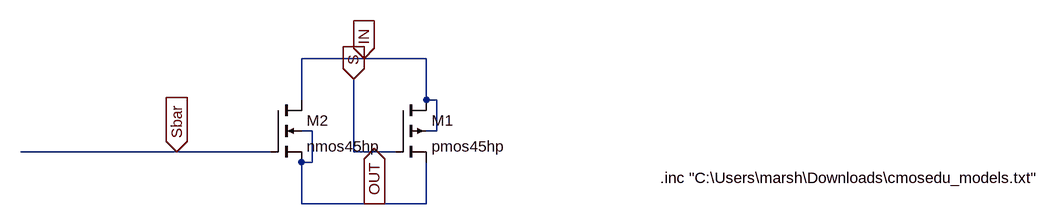
[diagram p0: schematic transgate5.asc]
transgate5.asc, the LTspice schematic file:
Version 4.1
SHEET 1 1048 680
WIRE -64 -48 -160 -48
WIRE 32 -48 -64 -48
WIRE -160 16 -160 -48
WIRE 32 16 32 -48
WIRE 48 16 32 16
WIRE -144 64 -160 64
WIRE 48 64 48 16
WIRE 48 64 32 64
WIRE -352 96 -592 96
WIRE -208 96 -352 96
WIRE -80 96 -80 -16
WIRE -16 96 -80 96
WIRE -144 112 -144 64
WIRE -144 112 -160 112
WIRE -160 176 -160 112
WIRE -48 176 -160 176
WIRE 32 176 32 112
WIRE 32 176 -48 176
FLAG -64 -48 IN
IOPIN -64 -48 In
FLAG -48 176 OUT
IOPIN -48 176 Out
FLAG -80 -16 S
IOPIN -80 -16 In
FLAG -352 96 Sbar
IOPIN -352 96 In
SYMBOL pmos4 -16 16 R0
SYMATTR InstName M1
SYMATTR Value pmos45hp
SYMATTR Value2 l=100n w=400n
SYMBOL nmos4 -208 16 R0
SYMATTR InstName M2
SYMATTR Value nmos45hp
SYMATTR Value2 l=100n w=400n
TEXT 392 136 Left 2 !.inc "C:\\Users\\marsh\\Downloads\\cmosedu_models.txt"

The netlist it stands for:
* transgate5.asc
M1 IN S OUT IN pmos45hp l=100n w=400n
M2 IN Sbar OUT OUT nmos45hp l=100n w=400n
.model NMOS NMOS
.model PMOS PMOS
.lib standard.mos
.inc "C:\Users\marsh\Downloads\cmosedu_models.txt"
.backanno
.end